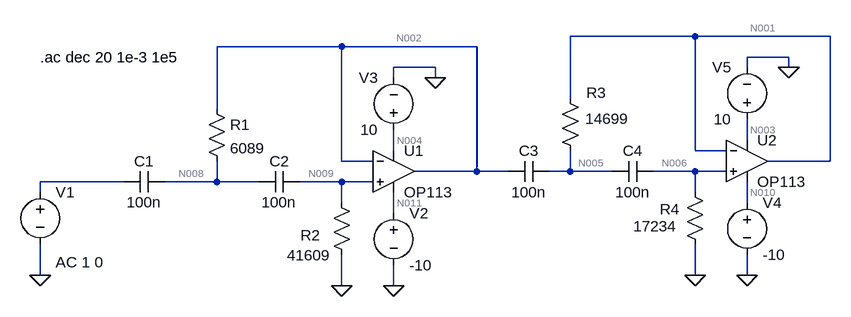
[diagram p0: schematic Draft1.asc]
Draft1.asc, the LTspice schematic file:
Version 4
SHEET 1 1268 680
WIRE 960 -112 768 -112
WIRE 1168 -112 960 -112
WIRE 416 -96 224 -96
WIRE 624 -96 416 -96
WIRE 1104 -80 1040 -80
WIRE 560 -64 496 -64
WIRE 1040 -64 1040 -80
WIRE 1104 -64 1104 -80
WIRE 496 -48 496 -64
WIRE 560 -48 560 -64
WIRE 768 -16 768 -112
WIRE 224 0 224 -96
WIRE 1040 48 1040 16
WIRE 496 64 496 32
WIRE 960 64 960 -112
WIRE 1008 64 960 64
WIRE 416 80 416 -96
WIRE 464 80 416 80
WIRE 1168 80 1168 -112
WIRE 1168 80 1072 80
WIRE 624 96 624 -96
WIRE 624 96 528 96
WIRE 672 96 624 96
WIRE 768 96 768 64
WIRE 768 96 736 96
WIRE 832 96 768 96
WIRE 960 96 896 96
WIRE 1008 96 960 96
WIRE 80 112 -48 112
WIRE 224 112 224 80
WIRE 224 112 144 112
WIRE 288 112 224 112
WIRE 416 112 352 112
WIRE 464 112 416 112
WIRE -48 128 -48 112
WIRE 960 128 960 96
WIRE 416 144 416 112
WIRE 1040 144 1040 112
WIRE 496 160 496 128
WIRE -48 256 -48 208
WIRE 960 256 960 208
WIRE 1040 256 1040 224
WIRE 416 272 416 224
WIRE 496 272 496 240
FLAG -48 256 0
FLAG 496 272 0
FLAG 560 -48 0
FLAG 416 272 0
FLAG 1040 256 0
FLAG 1104 -64 0
FLAG 960 256 0
SYMBOL voltage -48 112 R0
WINDOW 123 24 124 Left 2
WINDOW 39 0 0 Left 0
SYMATTR InstName V1
SYMATTR Value ""
SYMATTR Value2 AC 1 0
SYMBOL cap 144 96 R90
WINDOW 0 0 32 VBottom 2
WINDOW 3 32 32 VTop 2
SYMATTR InstName C1
SYMATTR Value 100n
SYMBOL res 208 -16 R0
SYMATTR InstName R1
SYMATTR Value 6089
SYMBOL cap 352 96 R90
WINDOW 0 0 32 VBottom 2
WINDOW 3 32 32 VTop 2
SYMATTR InstName C2
SYMATTR Value 100n
SYMBOL res 400 128 R0
WINDOW 0 -47 66 Left 2
WINDOW 3 -68 97 Left 2
SYMATTR InstName R2
SYMATTR Value 41609
SYMBOL OpAmps\\OP113 496 32 R0
SYMATTR InstName U1
SYMBOL voltage 496 144 R0
WINDOW 123 0 0 Left 0
WINDOW 39 0 0 Left 0
SYMATTR InstName V2
SYMATTR Value -10
SYMBOL voltage 496 48 R180
WINDOW 0 24 96 Left 2
WINDOW 3 24 16 Left 2
WINDOW 123 0 0 Left 0
WINDOW 39 0 0 Left 0
SYMATTR InstName V3
SYMATTR Value 10
SYMBOL cap 736 80 R90
WINDOW 0 0 32 VBottom 2
WINDOW 3 32 32 VTop 2
SYMATTR InstName C3
SYMATTR Value 100n
SYMBOL res 752 -32 R0
WINDOW 0 41 7 Left 2
WINDOW 3 39 47 Left 2
SYMATTR InstName R3
SYMATTR Value 14699
SYMBOL cap 896 80 R90
WINDOW 0 0 32 VBottom 2
WINDOW 3 32 32 VTop 2
SYMATTR InstName C4
SYMATTR Value 100n
SYMBOL res 944 112 R0
WINDOW 0 -38 42 Left 2
WINDOW 3 -79 68 Left 2
SYMATTR InstName R4
SYMATTR Value 17234
SYMBOL OpAmps\\OP113 1040 16 R0
SYMATTR InstName U2
SYMBOL voltage 1040 128 R0
WINDOW 123 0 0 Left 0
WINDOW 39 0 0 Left 0
SYMATTR InstName V4
SYMATTR Value -10
SYMBOL voltage 1040 32 R180
WINDOW 0 24 96 Left 2
WINDOW 3 24 16 Left 2
WINDOW 123 0 0 Left 0
WINDOW 39 0 0 Left 0
SYMATTR InstName V5
SYMATTR Value 10
TEXT -48 -80 Left 2 !.ac dec 20 1e-3 1e5

The netlist it stands for:
* Draft1.asc
V1 N007 0 AC 1 0
C1 N008 N007 100n
R1 N002 N008 6089
C2 N009 N008 100n
R2 N009 0 41609
XU1 N009 N002 N004 N011 N002 OP113  ; pins In+ In- V+ V- OUT
V2 N011 0 -10
V3 N004 0 10
C3 N005 N002 100n
R3 N001 N005 14699
C4 N006 N005 100n
R4 N006 0 17234
XU2 N006 N001 N003 N010 N001 OP113  ; pins In+ In- V+ V- OUT
V4 N010 0 -10
V5 N003 0 10
.ac dec 20 1e-3 1e5
.lib ADI.lib
.backanno
.end

* Results of the author's LTspice run, read from the files saved beside the schematic
* Operating Point, zero values left out:
*   V(n008) = 10.99 mV
*   V(n002) = 10.99 mV
*   V(n009) = 11.02 mV
*   V(n011) = -10 V
*   V(n004) = 10 V
*   V(n005) = 4.538 mV
*   V(n001) = 4.538 mV
*   V(n006) = 4.564 mV
*   V(n010) = -10 V
*   V(n003) = 10 V
*   I(R2) = 264.8 nA
*   I(R4) = 264.8 nA
*   I(V2) = 1.525 mA
*   I(V3) = -1.526 mA
*   I(V4) = 1.525 mA
*   I(V5) = -1.526 mA
*   Ix(u1:3) = -264.8 nA
*   Ix(u1:2) = -214.8 nA
*   Ix(u1:7) = 1.526 mA
*   Ix(u1:4) = -1.525 mA
*   Ix(u1:6) = 214.8 nA
*   Ix(u2:3) = -264.8 nA
*   Ix(u2:2) = -214.8 nA
*   Ix(u2:7) = 1.526 mA
*   Ix(u2:4) = -1.525 mA
*   Ix(u2:6) = 214.8 nA
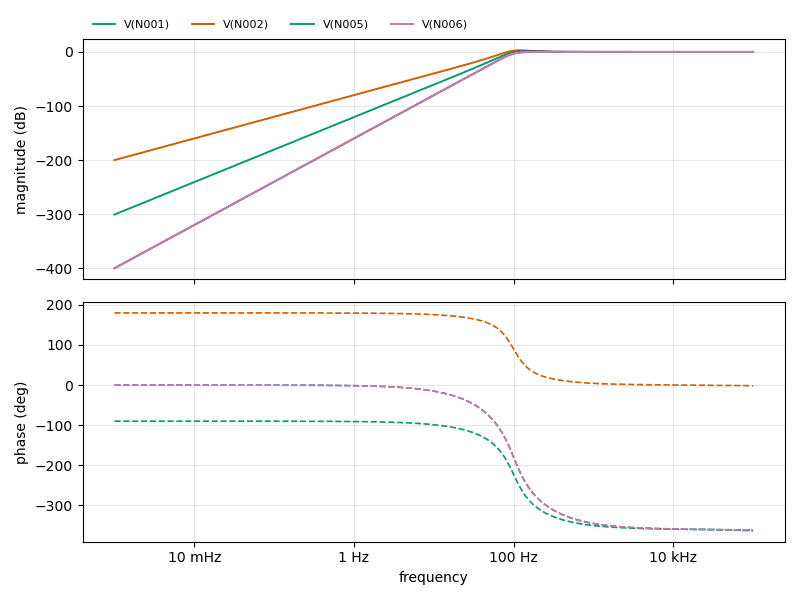
[diagram p1: AC Analysis of Draft1.asc, plotted from the saved traces]
* AC Analysis, 1 run:
*   V(N001): -400.00 dB at 1 mHz, -0.00 dB at 100 kHz, peak -0.00 dB at 354.8 Hz, 3 dB below the peak at 99.96 Hz
*   V(N002): -200.00 dB at 1 mHz, -0.00 dB at 100 kHz, peak 2.96 dB at 125.9 Hz, 3 dB below the peak at 84.11 Hz
*   V(N005): -300.69 dB at 1 mHz, -0.00 dB at 100 kHz, peak 1.28 dB at 141.3 Hz, 3 dB below the peak at 92.07 Hz
*   V(N006): -400.00 dB at 1 mHz, -0.00 dB at 100 kHz, peak -0.00 dB at 354.8 Hz, 3 dB below the peak at 99.96 Hz